# Altium schematic sheet main.SchDoc
size A4
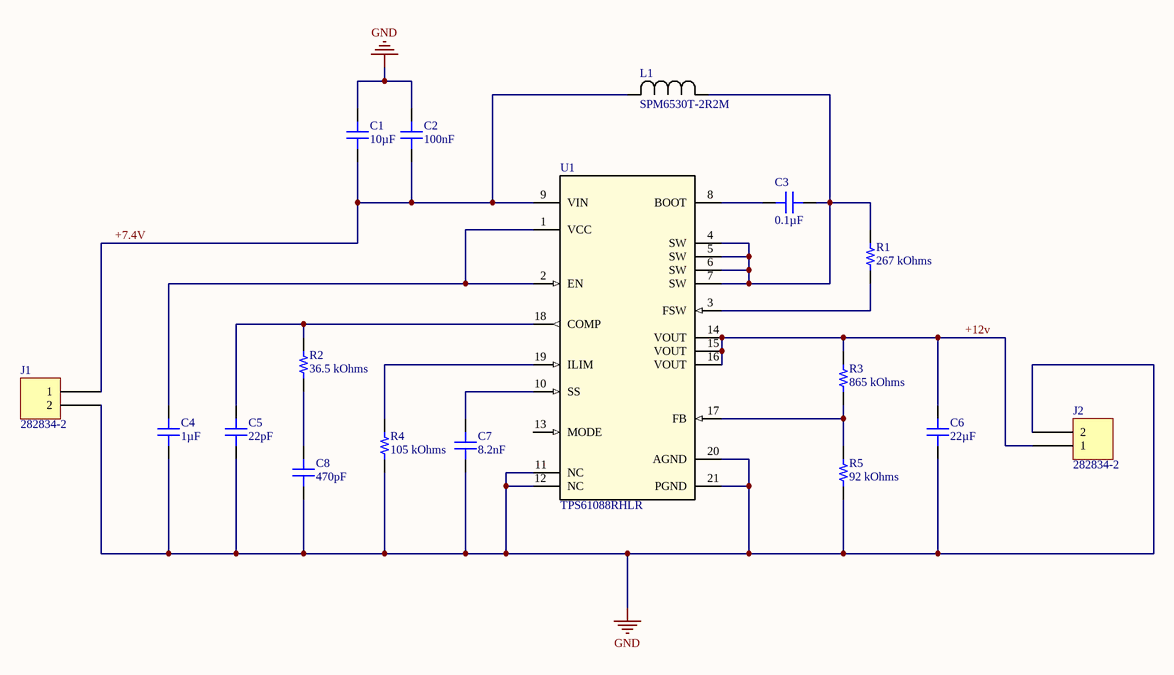
[diagram p0: main.SchDoc]

## Parts
C1  10µF  [CAP 1210_3225 - 2.8MM]
C2  100nF  [CAP 0603_1608]
C3  0.1µF  [CAP 0603_1608]
C4  1µF  [CAP 0603_1608]
C5  22pF  [CAP 0603_1608]
C6  22µF  [CAP 1210_3225 - 2.8MM]
C7  8.2nF  [CAP 0603_1608]
C8  value 470pF  [CAP 0603_1608]  (hidden comment: Ccomp=Value)
J1  282834-2  [TE 282834-2]
J2  282834-2  [TE 282834-2]
L1  SPM6530T-2R2M  [IND_SPM6530_TDK]
R1  267 kOhms  [RES 0603_1608]
R2  36.5 kOhms  [RES 0603_1608]
R3  865 kOhms  [RES 0603_1608]
R4  105 kOhms  [RES 0603_1608]
R5  92 kOhms  [RES 0805_2012]
U1  TPS61088RHLR  [RHL0020A]

## Nets
GND: C1.2 C2.2 C4.1 C5.1 C6.1 C7.1 C8.1 J1.2 J2.2 R4.1 R5.2 U1.11(NC) U1.12(NC) U1.20(AGND) U1.21(PGND)
+7.4V: C1.1 C2.1 J1.1 L1.2 U1.9(VIN)
+12v: C6.2 J2.1 R3.2 U1.14(VOUT) U1.15(VOUT) U1.16(VOUT)
NetC3_1: C3.1 U1.8(BOOT)
NetC3_2: C3.2 L1.1 R1.2 U1.4(SW) U1.5(SW) U1.6(SW) U1.7(SW)
NetC4_2: C4.2 U1.1(VCC) U1.2(EN)
NetC5_2: C5.2 R2.2 U1.18(COMP)
NetC7_2: C7.2 U1.10(SS)
NetC8_2: C8.2 R2.1
NetR1_1: R1.1 U1.3(FSW)
NetR3_1: R3.1 R5.1 U1.17(FB)
NetR4_2: R4.2 U1.19(ILIM)

Not connected (* = marked no-connect by the designer): U1 13(MODE)

## Library data of the parts
C1 = GCJ32EC71H106KA01L: CAP CER 10UF 50V X7S 1210; Manufacturer: Murata Electronics; Tolerance: ±10%; Part Number: GCJ32EC71H106KA01L; Value: 10µF; Applications: Automotive, Boardflex Sensitive; Capacitance: 10µF; ComponentLink1Description: Datasheet; ComponentLink1URL: https://search.murata.co.jp/Ceramy/image/img/A01X/G101/ENG/GCJ32EC71H106KA01-01.pdf; ComponentLink2Description: DigiKey Link; ComponentLink2URL: http://digikey.com/product-detail/en/murata-electronics/GCJ32EC71H106KA01L/490-14418-1-ND/6606879; Device Package: 1210 (3225 Metric); Features: Soft Termination; LastUpdated: 02.09.2020 1:10:53; Lifecycle Status: Active; Minimum Order: 1; Mounting Type: Surface Mount, MLCC; Operating Temperature: -55°C ~ 125°C; Package / Case: 1210 (3225 Metric); Packaging: TapeAndReel; PartId: 23622; Part Status: Active; Price: 0.53; Ratings: AEC-Q200; Series: GCJ; Size / Dimension: 0.126" L x 0.098" W (3.20mm x 2.50mm); Supplier 1: DigiKey; Supplier Part Number 1: 490-14418-1-ND; Temperature Coefficient: X7S; Thickness (Max): 0.110" (2.80mm); Voltage - Rated: 50V
C2 C5 = 06033A220KAT2A: CAP CER 22PF 25V C0G/NP0 0603; Manufacturer: AVX Corporation; Temperature Coefficient: C0G, NP0; Tolerance: ±10%; Part Number: 06033A220KAT2A; Applications: General Purpose; Capacitance: 22pF; ComponentLink1Description: Datasheet; ComponentLink1URL: http://datasheets.avx.com/C0GNP0-Dielectric.pdf; ComponentLink2Description: DigiKey Link; ComponentLink2URL: http://digikey.com/product-detail/en/avx-corporation/06033A220KAT2A/478-11803-1-ND/8573439; Device Package: 0603 (1608 Metric); LastUpdated: 02.09.2020 1:03:34; Lifecycle Status: Active; Minimum Order: 1; Mounting Type: Surface Mount, MLCC; Operating Temperature: -55°C ~ 125°C; Package / Case: 0603 (1608 Metric); Packaging: TapeAndReel; PartId: 3017; Part Status: Active; Price: 0.04; Series: -; Size / Dimension: 0.063" L x 0.032" W (1.60mm x 0.81mm); Supplier 1: DigiKey; Supplier Part Number 1: 478-11803-1-ND; Thickness (Max): 0.035" (0.90mm); Voltage - Rated: 25V
  C2: Value: 100nF
  C5: Value: 22pF
C3 = 0603YC104JAT4A: CAP CER 0.1UF 16V X7R 0603; Manufacturer: AVX Corporation; Tolerance: ±5%; Part Number: 0603YC104JAT4A; Value: 0.1µF; Applications: General Purpose; Capacitance: 0.1µF; ComponentLink1Description: Datasheet; ComponentLink1URL: http://datasheets.avx.com/X7RDielectric.pdf; ComponentLink2Description: DigiKey Link; ComponentLink2URL: http://digikey.com/product-detail/en/avx-corporation/0603YC104JAT4A/478-7621-1-ND/7536239; Device Package: 0603 (1608 Metric); LastUpdated: 02.09.2020 1:03:19; Lifecycle Status: Active; Minimum Order: 1; Mounting Type: Surface Mount, MLCC; Operating Temperature: -55°C ~ 125°C; Package / Case: 0603 (1608 Metric); Packaging: TapeAndReel; PartId: 11638; Part Status: Active; Price: 0.03; Series: -; Size / Dimension: 0.063" L x 0.032" W (1.60mm x 0.81mm); Supplier 1: DigiKey; Supplier Part Number 1: 478-7621-1-ND; Temperature Coefficient: X7R; Thickness (Max): 0.035" (0.90mm); Voltage - Rated: 16V
C4 = C0603C105K4PACTU: CAP CER 1UF 16V X5R 0603; Manufacturer: KEMET; Tolerance: ±10%; Part Number: C0603C105K4PACTU; Value: 1µF; Applications: General Purpose; Capacitance: 1µF; ComponentLink1Description: Datasheet; ComponentLink1URL: https://api.kemet.com/component-edge/download/datasheet/C0603C105K4PACTU.pdf; ComponentLink2Description: DigiKey Link; ComponentLink2URL: http://digikey.com/product-detail/en/kemet/C0603C105K4PACTU/399-5090-1-ND/1465624; Device Package: 0603 (1608 Metric); LastUpdated: 02.09.2020 1:03:33; Lifecycle Status: Active; Minimum Order: 1; Mounting Type: Surface Mount, MLCC; Operating Temperature: -55°C ~ 85°C; Package / Case: 0603 (1608 Metric); Packaging: TapeAndReel; PartId: 3768; Part Status: Active; Price: 0.02; Series: SMD Comm X5R; Size / Dimension: 0.063" L x 0.031" W (1.60mm x 0.80mm); Supplier 1: DigiKey; Supplier Part Number 1: 399-5090-1-ND; Temperature Coefficient: X5R; Thickness (Max): 0.035" (0.90mm); Voltage - Rated: 16V
C6 = GRM32ER71E226ME15K: CAP CER 22UF 25V X7R 1210; Manufacturer: Murata Electronics; Tolerance: ±20%; Part Number: GRM32ER71E226ME15K; Value: 22µF; Applications: General Purpose; Capacitance: 22µF; ComponentLink1Description: Datasheet; ComponentLink1URL: https://search.murata.co.jp/Ceramy/image/img/A01X/G101/ENG/GRM32ER71E226ME15-01.pdf; ComponentLink2Description: DigiKey Link; ComponentLink2URL: http://digikey.com/product-detail/en/murata-electronics/GRM32ER71E226ME15K/490-14682-1-ND/6606288; Device Package: 1210 (3225 Metric); LastUpdated: 02.09.2020 1:10:50; Lifecycle Status: Active; Minimum Order: 1; Mounting Type: Surface Mount, MLCC; Operating Temperature: -55°C ~ 125°C; Package / Case: 1210 (3225 Metric); Packaging: TapeAndReel; PartId: 24019; Part Status: Active; Price: 0.35; Series: GRM; Size / Dimension: 0.126" L x 0.098" W (3.20mm x 2.50mm); Supplier 1: DigiKey; Supplier Part Number 1: 490-14682-1-ND; Temperature Coefficient: X7R; Thickness (Max): 0.106" (2.70mm); Voltage - Rated: 25V
C7 = C0603C105K4PACTU: CAP CER 1UF 16V X5R 0603; Manufacturer: KEMET; Capacitance: 1µF; Tolerance: ±10%; Part Number: C0603C105K4PACTU; Value: 8.2nF; Applications: General Purpose; ComponentLink1Description: Datasheet; ComponentLink1URL: https://api.kemet.com/component-edge/download/datasheet/C0603C105K4PACTU.pdf; ComponentLink2Description: DigiKey Link; ComponentLink2URL: http://digikey.com/product-detail/en/kemet/C0603C105K4PACTU/399-5090-1-ND/1465624; Device Package: 0603 (1608 Metric); LastUpdated: 02.09.2020 1:03:33; Lifecycle Status: Active; Minimum Order: 1; Mounting Type: Surface Mount, MLCC; Operating Temperature: -55°C ~ 85°C; Package / Case: 0603 (1608 Metric); Packaging: TapeAndReel; PartId: 3768; Part Status: Active; Price: 0.02; Series: SMD Comm X5R; Size / Dimension: 0.063" L x 0.031" W (1.60mm x 0.80mm); Supplier 1: DigiKey; Supplier Part Number 1: 399-5090-1-ND; Temperature Coefficient: X5R; Thickness (Max): 0.035" (0.90mm); Voltage - Rated: 16V
C8 = 885012006027: CAP CER 470PF 16V C0G/NP0 0603; Manufacturer: Würth Elektronik; Temperature Coefficient: C0G, NP0; Tolerance: ±5%; Part Number: 885012006027; Applications: General Purpose; Capacitance: 470pF; ComponentLink1Description: Datasheet; ComponentLink1URL: https://katalog.we-online.de/pbs/datasheet/885012006027.pdf; ComponentLink2Description: DigiKey Link; ComponentLink2URL: http://digikey.com/product-detail/en/w-rth-elektronik/885012006027/732-7770-1-ND/5454397; Device Package: 0603 (1608 Metric); LastUpdated: 02.09.2020 1:03:24; Lifecycle Status: Active; Minimum Order: 1; Mounting Type: Surface Mount, MLCC; Operating Temperature: -55°C ~ 125°C; Package / Case: 0603 (1608 Metric); Packaging: TapeAndReel; PartId: 8947; Part Status: Active; Price: 0.05; Series: WCAP-CSGP; Size / Dimension: 0.063" L x 0.031" W (1.60mm x 0.80mm); Supplier 1: DigiKey; Supplier Part Number 1: 732-7770-1-ND; Thickness (Max): 0.034" (0.87mm); Voltage - Rated: 16V
J1 J2 = 282834-2: TERM BLK 2P SIDE ENT 2.54MM PCB; Manufacturer: TE Connectivity AMP Connectors; Current: 10A; Mating Orientation: Horizontal with Board; Number of Levels: 1; Pitch: 0.100" (2.54mm); Positions Per Level: 2; Voltage: 150V; Wire Gauge: 16-30 AWG; Wire Termination: Screw - Rising Cage Clamp; Part Number: 282834-2; Color: Green; ComponentLink1Description: Datasheet; ComponentLink1URL: https://www.te.com/commerce/DocumentDelivery/DDEController?Action=srchrtrv&DocNm=282834&DocType=Customer+Drawing&DocLang=English; ComponentLink2Description: DigiKey Link; ComponentLink2URL: http://digikey.com/product-detail/en/te-connectivity-amp-connectors/282834-2/A98333-ND/1150135; LastUpdated: 15.01.2020 4:15:38; Lifecycle Status: Active; Minimum Order: 1; Mounting Type: Through Hole; Packaging: Bulk; Part Status: Active; Price: 0.88; Series: Buchanan; Supplier 1: DigiKey; Supplier Part Number 1: A98333-ND
L1 = SPM6530T-2R2M: No Description Available; Vendor: TDK; Built_By: EMA_UL_Team; SourceLibrary: TDK_2015_05_22; Manufacturer_Part_Number: SPM6530T-2R2M; Copyright: Copyright (C) 2018 Accelerated Designs. All rights reserved
R1 = RC0603FR-07267KL: RES SMD 267K OHM 1% 1/10W 0603; Manufacturer: Yageo; Power (Watts): 0.1W, 1/10W; Temperature Coefficient: ±100ppm/°C; Part Number: RC0603FR-07267KL; Value: 267 kOhms; ComponentLink1Description: Datasheet; ComponentLink1URL: https://www.yageo.com/upload/media/product/productsearch/datasheet/rchip/PYu-RC_Group_51_RoHS_L_10.pdf; ComponentLink2Description: DigiKey Link; ComponentLink2URL: http://digikey.com/product-detail/en/yageo/RC0603FR-07267KL/311-267KHRCT-ND/730045; Composition: Thick Film; Device Package: 0603 (1608 Metric); Features: Moisture Resistant; Height - Seated (Max): 0.022" (0.55mm); LastUpdated: 02.09.2020 1:10:19; Lifecycle Status: Active; Minimum Order: 1; Number of Terminations: 2; Operating Temperature: -55°C ~ 155°C; Package / Case: 0603 (1608 Metric); Packaging: CutTape; PartId: 7613; Part Status: Active; Price: 0.10; Resistance: 267 kOhms; Series: RC; Size / Dimension: 0.063" L x 0.031" W (1.60mm x 0.80mm); Supplier 1: DigiKey; Supplier Part Number 1: 311-267KHRCT-ND; Supplier Device Package: 0603; Tolerance: ±1%
R2 = CR0603-FX-3652ELF: RES SMD 36.5K OHM 1% 1/10W 0603; Manufacturer: Bourns Inc.; Power (Watts): 0.1W, 1/10W; Temperature Coefficient: ±100ppm/°C; Part Number: CR0603-FX-3652ELF; Value: 36.5 kOhms; ComponentLink1Description: Datasheet; ComponentLink1URL: https://www.bourns.com/docs/Product-Datasheets/CHPREZTR.pdf; ComponentLink2Description: DigiKey Link; ComponentLink2URL: http://digikey.com/product-detail/en/bourns-inc/CR0603-FX-3652ELF/CR0603-FX-3652ELFCT-ND/4247786; Composition: Thick Film; Device Package: 0603 (1608 Metric); Features: Moisture Resistant; Height - Seated (Max): 0.022" (0.55mm); LastUpdated: 02.09.2020 1:10:18; Lifecycle Status: Active; Minimum Order: 1; Number of Terminations: 2; Operating Temperature: -55°C ~ 155°C; Package / Case: 0603 (1608 Metric); Packaging: TapeAndReel; PartId: 8146; Part Status: Active; Price: 0.01; Resistance: 36.5 kOhms; Series: CR0603; Size / Dimension: 0.063" L x 0.031" W (1.60mm x 0.80mm); Supplier 1: DigiKey; Supplier Part Number 1: CR0603-FX-3652ELFCT-ND; Supplier Device Package: 0603; Tolerance: ±1%
R3 = RC0603FR-07267KL: RES SMD 267K OHM 1% 1/10W 0603; Manufacturer: Yageo; Power (Watts): 0.1W, 1/10W; Resistance: 267 kOhms; Temperature Coefficient: ±100ppm/°C; Part Number: RC0603FR-07267KL; Value: 865 kOhms; ComponentLink1Description: Datasheet; ComponentLink1URL: https://www.yageo.com/upload/media/product/productsearch/datasheet/rchip/PYu-RC_Group_51_RoHS_L_10.pdf; ComponentLink2Description: DigiKey Link; ComponentLink2URL: http://digikey.com/product-detail/en/yageo/RC0603FR-07267KL/311-267KHRCT-ND/730045; Composition: Thick Film; Device Package: 0603 (1608 Metric); Features: Moisture Resistant; Height - Seated (Max): 0.022" (0.55mm); LastUpdated: 02.09.2020 1:10:19; Lifecycle Status: Active; Minimum Order: 1; Number of Terminations: 2; Operating Temperature: -55°C ~ 155°C; Package / Case: 0603 (1608 Metric); Packaging: CutTape; PartId: 7613; Part Status: Active; Price: 0.10; Series: RC; Size / Dimension: 0.063" L x 0.031" W (1.60mm x 0.80mm); Supplier 1: DigiKey; Supplier Part Number 1: 311-267KHRCT-ND; Supplier Device Package: 0603; Tolerance: ±1%
R4 = RC0603FR-07105KL: RES SMD 105K OHM 1% 1/10W 0603; Manufacturer: Yageo; Power (Watts): 0.1W, 1/10W; Temperature Coefficient: ±100ppm/°C; Part Number: RC0603FR-07105KL; Value: 105 kOhms; ComponentLink1Description: Datasheet; ComponentLink1URL: https://www.yageo.com/upload/media/product/productsearch/datasheet/rchip/PYu-RC_Group_51_RoHS_L_10.pdf; ComponentLink2Description: DigiKey Link; ComponentLink2URL: http://digikey.com/product-detail/en/yageo/RC0603FR-07105KL/311-105KHRCT-ND/729840; Composition: Thick Film; Device Package: 0603 (1608 Metric); Features: Moisture Resistant; Height - Seated (Max): 0.022" (0.55mm); LastUpdated: 02.09.2020 1:10:19; Lifecycle Status: Active; Minimum Order: 1; Number of Terminations: 2; Operating Temperature: -55°C ~ 155°C; Package / Case: 0603 (1608 Metric); Packaging: CutTape; PartId: 7511; Part Status: Active; Price: 0.10; Resistance: 105 kOhms; Series: RC; Size / Dimension: 0.063" L x 0.031" W (1.60mm x 0.80mm); Supplier 1: DigiKey; Supplier Part Number 1: 311-105KHRCT-ND; Supplier Device Package: 0603; Tolerance: ±1%
R5 = RN73C2A392KBTDF: RES SMD 392K OHM 0.1% 1/10W 0805; Manufacturer: TE Connectivity Passive Product; Power (Watts): 0.1W, 1/10W; Resistance: 392 kOhms; Temperature Coefficient: ±10ppm/°C; Part Number: RN73C2A392KBTDF; Value: 92 kOhms; ComponentLink1Description: Datasheet; ComponentLink1URL: https://www.te.com/commerce/DocumentDelivery/DDEController?Action=srchrtrv&DocNm=1773270&DocType=DS&DocLang=English; ComponentLink2Description: DigiKey Link; ComponentLink2URL: http://digikey.com/product-detail/en/te-connectivity-passive-product/RN73C2A392KBTDF/A103425CT-ND/2730640; Composition: Thin Film; Device Package: 0805 (2012 Metric); Height - Seated (Max): 0.026" (0.65mm); LastUpdated: 02.09.2020 1:14:40; Lifecycle Status: Active; Minimum Order: 1; Number of Terminations: 2; Operating Temperature: -55°C ~ 155°C; Package / Case: 0805 (2012 Metric); Packaging: TapeAndReel; PartId: 46853; Part Status: Active; Price: 0.37; Series: RN73, Holsworthy; Size / Dimension: 0.079" L x 0.049" W (2.00mm x 1.25mm); Supplier 1: DigiKey; Supplier Part Number 1: A103425CT-ND; Supplier Device Package: 0805; Tolerance: ±0.1%
U1 = TPS61088RHLR: No Description Available; Alternate_PartNumber: TPS61088RHLT; Manufacturer: Texas Instruments; CompType: IC; PIN_COUNT: 21; Application_BuildNumber: *; PartNumber: TPS61088RHLR; PackageReference: RHL0020A; MountType: SMT; RoHS: Y; RefDes: RefDes; Type: DEV; Value: Value; Copyright: Copyright (C) 2018 Accelerated Designs. All rights reserved